# Altium project BluePitch.PrjPCB
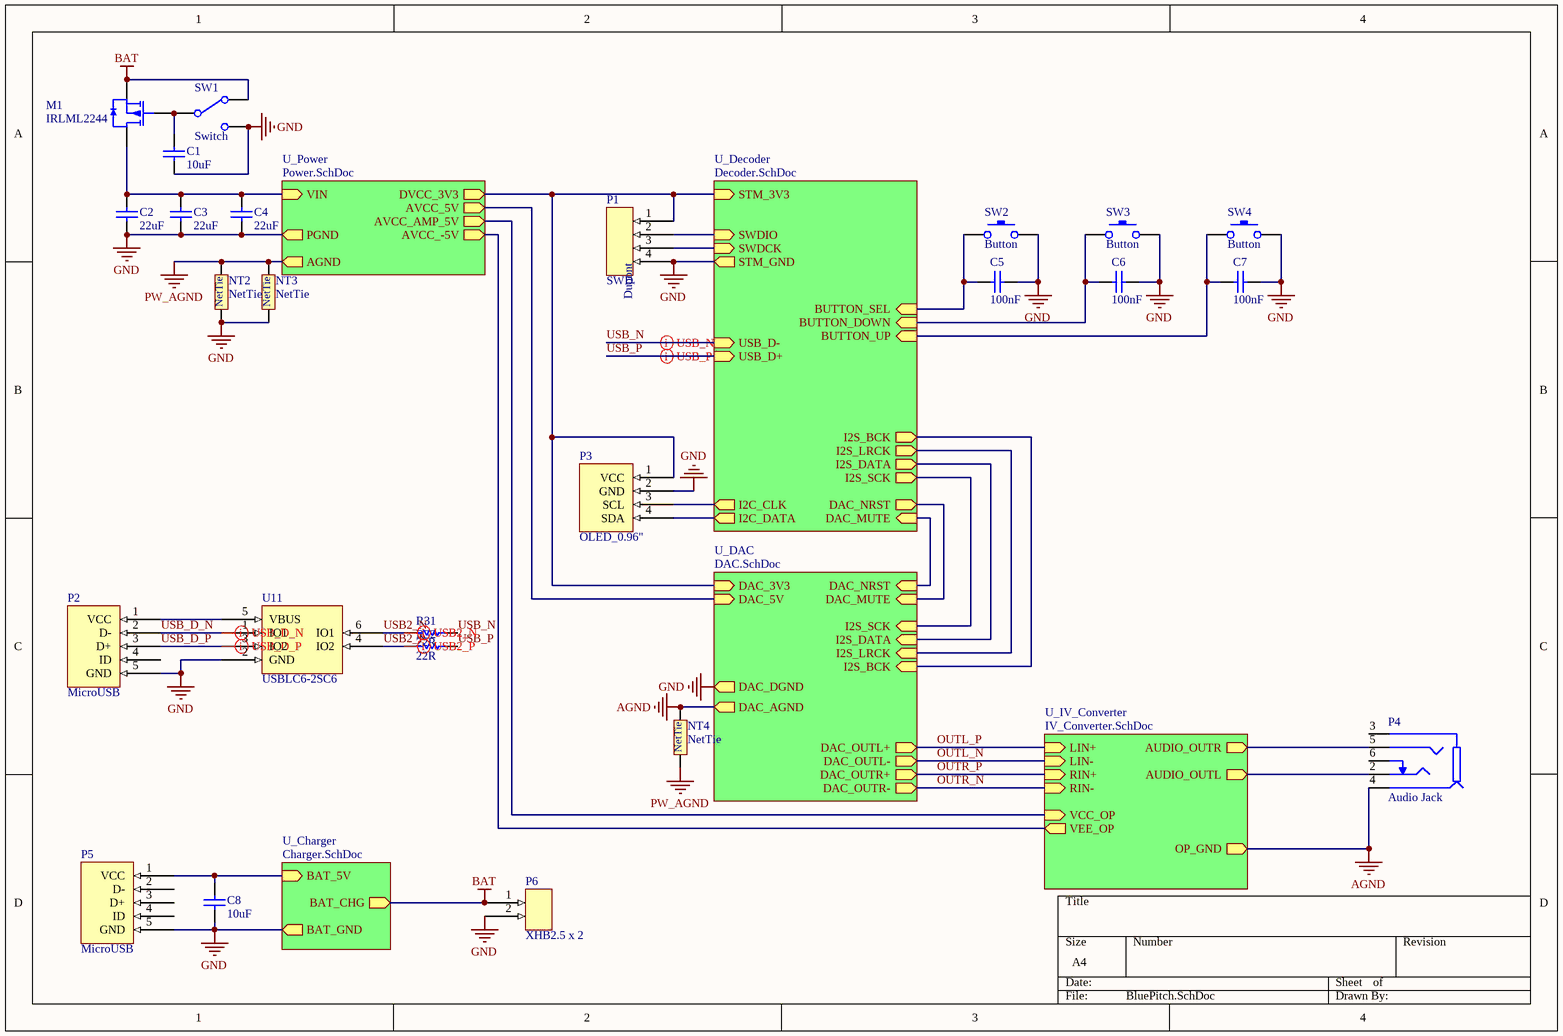
[diagram p0: BluePitch.SchDoc]
6 sheets, 145 parts. Net scope: hierarchical (ports join the sheet entries above them; power ports are global).
Board file: BluePitch.PcbDoc
Sheets:
  BluePitch.SchDoc
    U_DAC = DAC.SchDoc
    U_Decoder = Decoder.SchDoc
    U_IV_Converter = IV_Converter.SchDoc
    U_Power = Power.SchDoc
    U_Charger = Charger.SchDoc

## Sheet BluePitch.SchDoc
size A4

### Parts
C1  10uF  [SMC_0805]
C2  22uF  [SMC_1206]
C3  22uF  [SMC_1206]
C4  22uF  [SMC_1206]
C5  100nF  [SMC_0402]
C6  100nF  [SMC_0402]
C7  100nF  [SMC_0402]
C8  10uF  [SMC_0805]
M1  IRLML2244  [SOT95P237X112-3N]
NT2  NetTie  [NT_20]  (net tie, no BOM)
NT3  NetTie  [NT_20]  (net tie, no BOM)
NT4  NetTie  [NT_20]  (net tie, no BOM)
P1  SWD  [Dupont Female x 4]
P2  MicroUSB  [MicroUSB]
P3  OLED_0.96"  [OLED 0.96"]
P4  Audio Jack  [PJ-327A]
P5  MicroUSB  [MicroUSB]
P6  XHB2.5 x 2  [XHB2.5 x 2]
R31  22R  [SMR_0402]
R32  22R  [SMR_0402]
SW1  Switch  [Switch]
SW2  Button  [Button]
SW3  Button  [Button]
SW4  Button  [Button]
U11  USBLC6-2SC6  [SOT95P280X145-6N]

### Sub-sheets
U_Charger = Charger.SchDoc: BAT_5V (in), BAT_CHG (out), BAT_GND (out)
U_DAC = DAC.SchDoc: I2S_LRCK (in), I2S_DATA (in), I2S_BCK (in), I2S_SCK (in), DAC_MUTE (in), DAC_OUTL- (out), DAC_OUTL+ (out), DAC_OUTR- (out), DAC_OUTR+ (out), DAC_NRST (in), DAC_3V3 (in), DAC_DGND (out), DAC_AGND (out), DAC_5V (in)
U_Decoder = Decoder.SchDoc: I2S_DATA (out), I2S_LRCK (out), I2S_BCK (out), I2S_SCK (out), USB_D+ (in), USB_D- (in), SWDIO (in), SWDCK (in), I2C_CLK (out), I2C_DATA (out), STM_3V3 (in), STM_GND (out), BUTTON_UP (in), BUTTON_DOWN (in), BUTTON_SEL (in), DAC_MUTE (in), DAC_NRST (out)
U_IV_Converter = IV_Converter.SchDoc: AUDIO_OUTL (out), LIN+ (in), LIN- (in), AUDIO_OUTR (out), RIN+ (in), RIN- (in), VCC_OP (in), OP_GND (out), VEE_OP (out)
U_Power = Power.SchDoc: DVCC_3V3 (out), PGND (out), AGND (out), VIN (in), AVCC_-5V (out), AVCC_5V (out), AVCC_AMP_5V (out)

### Nets
AGND: NT4.2 P4.4(SLEEVE/L) ; sheet U_DAC/DAC_AGND, sheet U_IV_Converter/OP_GND
AMP_5V: sheet U_IV_Converter/VCC_OP, sheet U_Power/AVCC_AMP_5V
AMP_-5V: sheet U_IV_Converter/VEE_OP, sheet U_Power/AVCC_-5V
BAT: M1.S P6.1 SW1.2 ; sheet U_Charger/BAT_CHG
DAC_3V3: C2.2 C3.2 C4.2 M1.D P1.1 P3.1(VCC) ; sheet U_DAC/DAC_3V3, sheet U_Decoder/STM_3V3, sheet U_Power/DVCC_3V3, sheet U_Power/VIN
DAC_5V: sheet U_DAC/DAC_5V, sheet U_Power/AVCC_5V
GND: C1.1 C2.1 C3.1 C4.1 C5.2 C6.2 C7.2 C8.1 NT2.1 NT3.1 P1.4 P2.5(GND) P3.2(GND) P5.5(GND) P6.2 SW1.3 SW2.2 SW3.2 SW4.2 U11.2(GND) ; sheet U_DAC/DAC_DGND, sheet U_Decoder/STM_GND, sheet U_Power/PGND, sheet U_Charger/BAT_GND  [project net DAC_DGND]
PW_AGND: NT2.2 NT3.2 NT4.1 ; sheet U_Power/AGND  [project net PAGND]
VCHG: C8.2 P5.1(VCC) ; sheet U_Charger/BAT_5V
OUTL_N: sheet U_DAC/DAC_OUTL-, sheet U_IV_Converter/LIN-
OUTL_P: sheet U_DAC/DAC_OUTL+, sheet U_IV_Converter/LIN+
OUTR_N: sheet U_DAC/DAC_OUTR-, sheet U_IV_Converter/RIN-
OUTR_P: sheet U_DAC/DAC_OUTR+, sheet U_IV_Converter/RIN+
USB2_N: R31.1 U11.6(IO1)
USB2_P: R32.1 U11.4(IO2)
USB_D_N: P2.2(D-) U11.1(IO1)
USB_D_P: P2.3(D+) U11.3(IO2)
USB_N: R31.2 ; sheet U_Decoder/USB_D-
USB_P: R32.2 ; sheet U_Decoder/USB_D+
NetC1_2: C1.2 M1.G SW1.1
NetC5_1: C5.1 SW2.1 ; sheet U_Decoder/BUTTON_SEL
NetC6_1: C6.1 SW3.1 ; sheet U_Decoder/BUTTON_DOWN
NetC7_1: C7.1 SW4.1 ; sheet U_Decoder/BUTTON_UP
NetP1_2: P1.2 ; sheet U_Decoder/SWDIO
NetP1_3: P1.3 ; sheet U_Decoder/SWDCK
NetP2_1: P2.1(VCC) U11.5(VBUS)
NetP3_3: P3.3(SCL) ; sheet U_Decoder/I2C_CLK
NetP3_4: P3.4(SDA) ; sheet U_Decoder/I2C_DATA
NetP4_2: P4.2(L) ; sheet U_IV_Converter/AUDIO_OUTL
NetP4_5: P4.5(R) ; sheet U_IV_Converter/AUDIO_OUTR
NetR5_2: sheet U_DAC/DAC_NRST, sheet U_Decoder/DAC_MUTE
NetU2_4: sheet U_DAC/I2S_LRCK, sheet U_Decoder/I2S_LRCK
NetU2_5: sheet U_DAC/I2S_DATA, sheet U_Decoder/I2S_DATA
NetU2_6: sheet U_DAC/I2S_BCK, sheet U_Decoder/I2S_BCK
NetU2_7: sheet U_DAC/I2S_SCK, sheet U_Decoder/I2S_SCK
NetU2_10: sheet U_DAC/DAC_MUTE, sheet U_Decoder/DAC_NRST

Not connected (* = marked no-connect by the designer): P2 4(ID); P4 3(SLEEVE) 6(CONT); P5 2(D-) 3(D+) 4(ID)

### Layout directives
differential pair: USB2_N, USB2_P, USB_D_N, USB_D_P, USB_N, USB_P

### Notes on the sheet
- (in symbol Dupont Header x 4) Dupont

### Library data of the parts
C1-C8 = Cap Ceramic
P1 = Dupont Header x 4
R31 R32 = Res SMT

## Sheet DAC.SchDoc
size A4
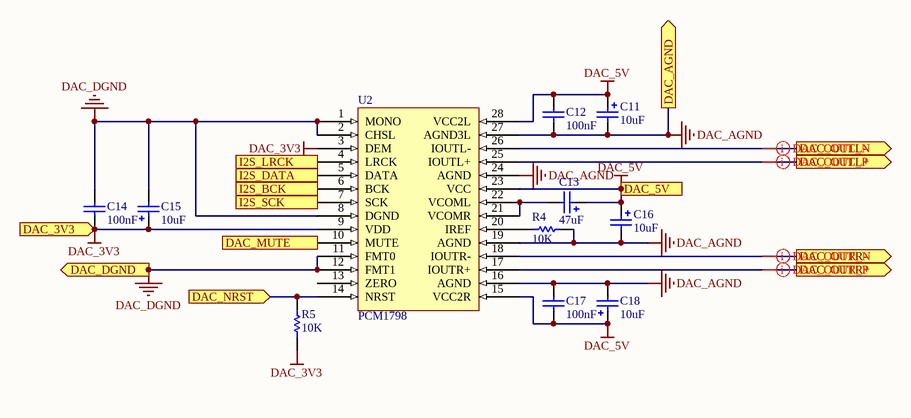
[diagram p1: DAC.SchDoc]

### Parts
C11  10uF  [THT_Cap5x11]
C12  100nF  [SMC_0402]
C13  47uF  [THT_Cap5x11]
C14  100nF  [SMC_0402]
C15  10uF  [THT_Cap5x11]
C16  10uF  [THT_Cap5x11]
C17  100nF  [SMC_0402]
C18  10uF  [THT_Cap5x11]
R4  10K  [SMR_0402]
R5  10K  [SMR_0402]
U2  PCM1798  [SOP65P780X200-28N]

### Ports
DAC_3V3 (in), DAC_5V (in), DAC_AGND (out), DAC_DGND (out), DAC_MUTE (in), DAC_NRST (in), DAC_OUTL+ (out), DAC_OUTL- (out), DAC_OUTR+ (out), DAC_OUTR- (out), I2S_BCK (in), I2S_DATA (in), I2S_LRCK (in), I2S_SCK (in)

### Nets
DAC_3V3: C14.1 C15.A R5.1 U2.3(DEM) U2.9(VDD) ; port DAC_3V3
DAC_5V: C11.A C12.2 C13.A C16.A C17.2 C18.A U2.15(VCC2R) U2.23(VCC) U2.28(VCC2L) ; port DAC_5V
DAC_AGND: C11.K C12.1 C16.K C17.1 C18.K R4.2 U2.16(AGND) U2.19(AGND) U2.24(AGND) U2.27(AGND3L) ; port DAC_AGND  [project net AGND]
DAC_DGND: C14.2 C15.K U2.1(MONO) U2.2(CHSL) U2.8(DGND) U2.11(FMT0) U2.12(FMT1) ; port DAC_DGND
OUTL_N: U2.26(IOUTL-) ; port DAC_OUTL-
OUTL_P: U2.25(IOUTL+) ; port DAC_OUTL+
OUTR_N: U2.18(IOUTR-) ; port DAC_OUTR-
OUTR_P: U2.17(IOUTR+) ; port DAC_OUTR+
NetC13_K: C13.K U2.21(VCOMR) U2.22(VCOML)
NetR4_1: R4.1 U2.20(IREF)
NetR5_2: R5.2 U2.14(NRST) ; port DAC_NRST
NetU2_4: U2.4(LRCK) ; port I2S_LRCK
NetU2_5: U2.5(DATA) ; port I2S_DATA
NetU2_6: U2.6(BCK) ; port I2S_BCK
NetU2_7: U2.7(SCK) ; port I2S_SCK
NetU2_10: U2.10(MUTE) ; port DAC_MUTE

Not connected (* = marked no-connect by the designer): U2 13(ZERO)

### Layout directives
differential pair: OUTL_N, OUTL_P, OUTR_N, OUTR_P

### Library data of the parts
C11 C13 C15 C16 C18 = Cap Electrolyte
C12 C14 C17 = Cap Ceramic
R4 R5 = Res SMT

## Sheet Decoder.SchDoc
size A4
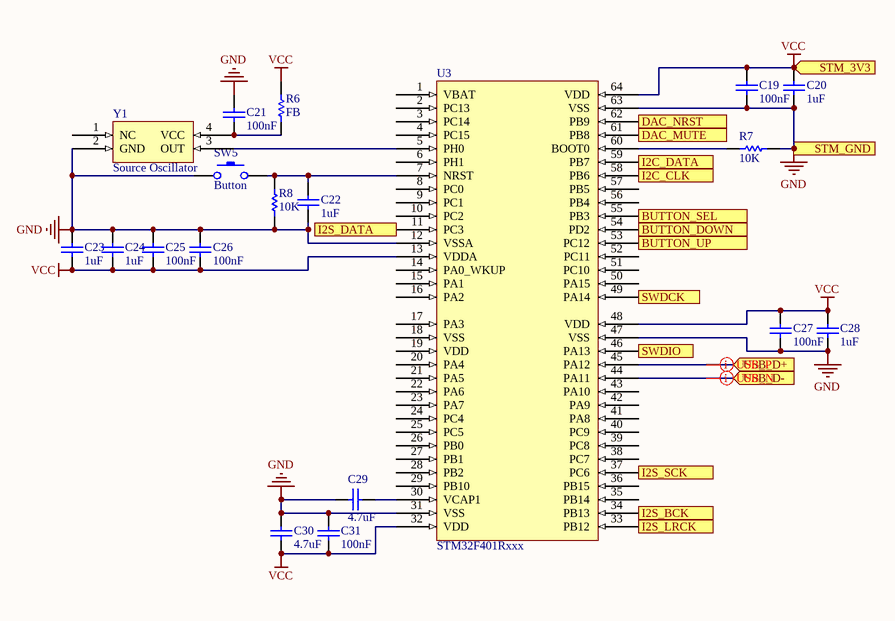
[diagram p2: Decoder.SchDoc]

### Parts
C19  100nF  [SMC_0402]
C20  1uF  [SMC_0402]
C21  100nF  [SMC_0402]
C22  1uF  [SMC_0402]
C23  1uF  [SMC_0402]
C24  1uF  [SMC_0402]
C25  100nF  [SMC_0402]
C26  100nF  [SMC_0402]
C27  100nF  [SMC_0402]
C28  1uF  [SMC_0402]
C29  4.7uF  [SMC_0402]
C30  4.7uF  [SMC_0402]
C31  100nF  [SMC_0402]
R6  FB  [SMR_0603]
R7  10K  [SMR_0402]
R8  10K  [SMR_0402]
SW5  Button  [Button]
U3  STM32F401Rxxx  [TSQFP50P1200X1200X160-64N]
Y1  Source Oscillator  [SMD_3225]

### Ports
BUTTON_DOWN (in), BUTTON_SEL (in), BUTTON_UP (in), DAC_MUTE (in), DAC_NRST (out), I2C_CLK (out), I2C_DATA (out), I2S_BCK (out), I2S_DATA (out), I2S_LRCK (out), I2S_SCK (out), STM_3V3 (in), STM_GND (out), SWDCK (in), SWDIO (in), USB_D+ (in), USB_D- (in)

### Nets
GND: C19.1 C20.1 C21.2 C22.1 C23.2 C24.2 C25.2 C26.2 C27.1 C28.1 C29.1 C30.2 C31.2 R7.2 R8.2 SW5.1 U3.12(VSSA) U3.31(VSS) U3.47(VSS) U3.63(VSS) Y1.2(GND) ; port STM_GND  [project net DAC_DGND]
VCC: C19.2 C20.2 C23.1 C24.1 C25.1 C26.1 C27.2 C28.2 C30.1 C31.1 R6.2 U3.13(VDDA) U3.32(VDD) U3.48(VDD) U3.64(VDD) ; port STM_3V3  [project net DAC_3V3]
USB_N: U3.44(PA11) ; port USB_D-
USB_P: U3.45(PA12) ; port USB_D+
NetC5_1: U3.55(PB3) ; port BUTTON_SEL
NetC6_1: U3.54(PD2) ; port BUTTON_DOWN
NetC7_1: U3.53(PC12) ; port BUTTON_UP
NetC21_1: C21.1 R6.1 Y1.4(VCC)
NetC22_2: C22.2 R8.1 SW5.2 U3.7(NRST)
NetC29_2: C29.2 U3.30(VCAP1)
NetP1_2: U3.46(PA13) ; port SWDIO
NetP1_3: U3.49(PA14) ; port SWDCK
NetP3_3: U3.58(PB6) ; port I2C_CLK
NetP3_4: U3.59(PB7) ; port I2C_DATA
NetR5_2: U3.61(PB8) ; port DAC_MUTE
NetR7_1: R7.1 U3.60(BOOT0)
NetU2_4: U3.33(PB12) ; port I2S_LRCK
NetU2_5: U3.11(PC3) ; port I2S_DATA
NetU2_6: U3.34(PB13) ; port I2S_BCK
NetU2_7: U3.37(PC6) ; port I2S_SCK
NetU2_10: U3.62(PB9) ; port DAC_NRST
NetU3_5: U3.5(PH0) Y1.3(OUT)

Not connected (* = marked no-connect by the designer): U3 1(VBAT) 2(PC13) 3(PC14) 4(PC15) 6(PH1) 8(PC0) 9(PC1) 10(PC2) 14(PA0_WKUP) 15(PA1) 16(PA2) 17(PA3) 18(VSS) 19(VDD) 20(PA4) 21(PA5) 22(PA6) 23(PA7) 24(PC4) 25(PC5) 26(PB0) 27(PB1) 28(PB2) 29(PB10) 35(PB14) 36(PB15) 38(PC7) 39(PC8) 40(PC9) 41(PA8) 42(PA9) 43(PA10) 50(PA15) 51(PC10) 52(PC11) 56(PB4) 57(PB5); Y1 1(NC)

### Layout directives
differential pair: USB_N, USB_P

### Library data of the parts
C19-C31 = Cap Ceramic
R6-R8 = Res SMT

## Sheet IV_Converter.SchDoc
size A4
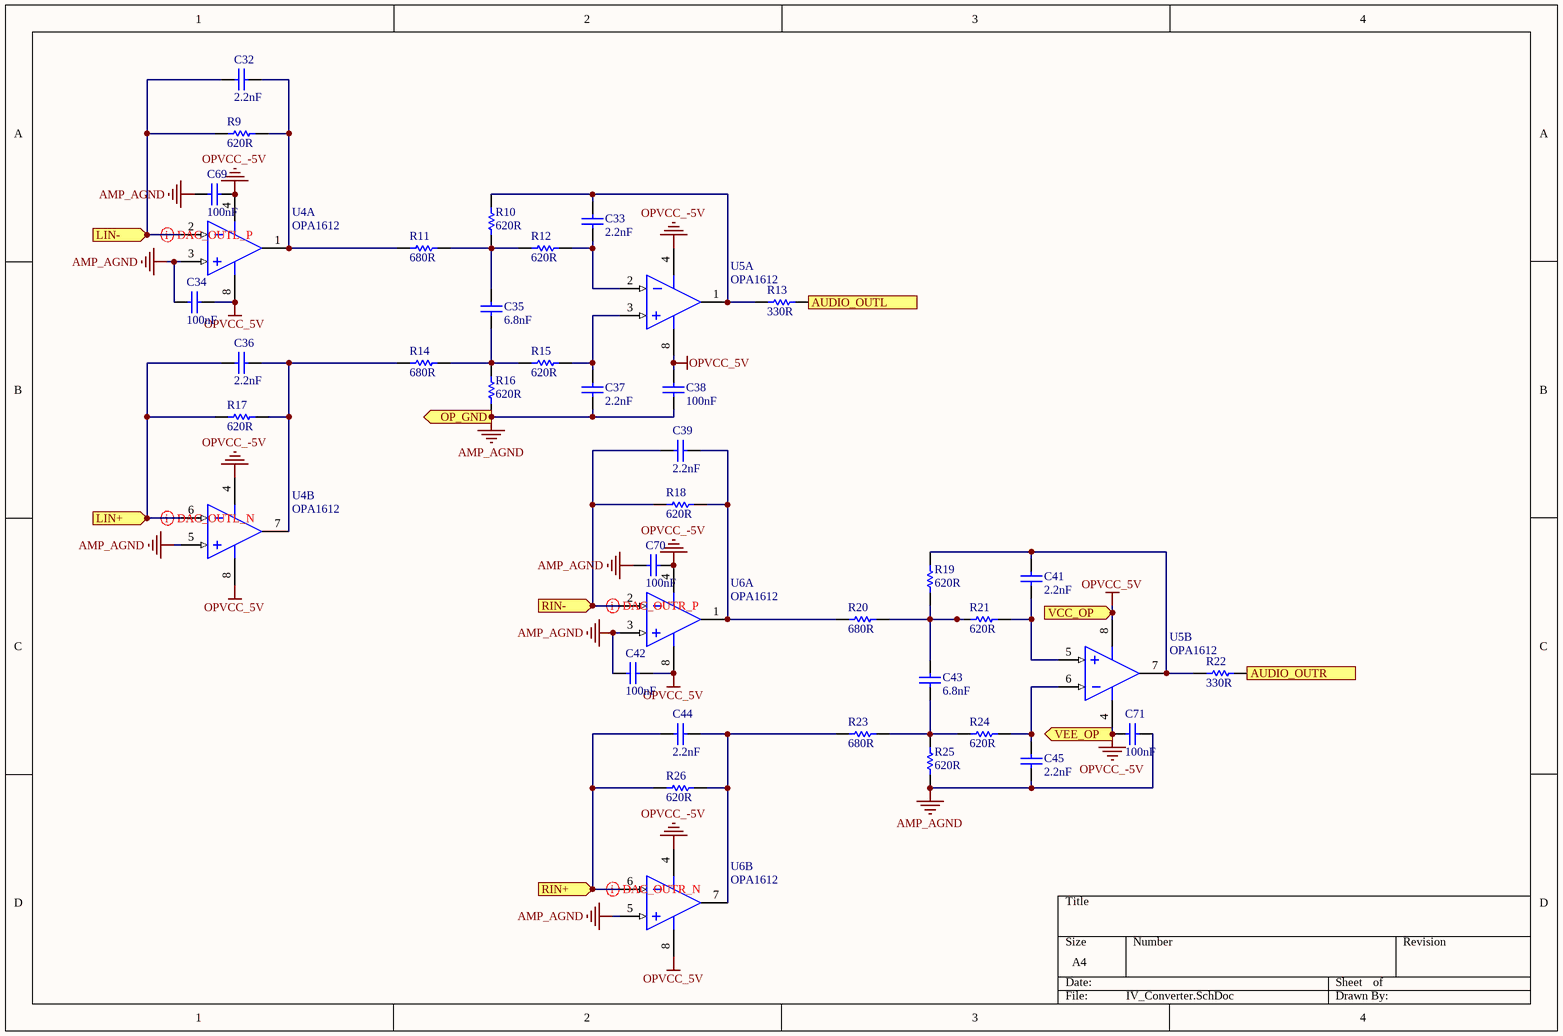
[diagram p3: IV_Converter.SchDoc]

### Parts
C32  2.2nF  [SMC_0805]
C33  2.2nF  [SMC_0805]
C34  100nF  [SMC_0402]
C35  6.8nF  [SMC_0805]
C36  2.2nF  [SMC_0805]
C37  2.2nF  [SMC_0805]
C38  100nF  [SMC_0402]
C39  2.2nF  [SMC_0805]
C41  2.2nF  [SMC_0805]
C42  100nF  [SMC_0402]
C43  6.8nF  [SMC_0805]
C44  2.2nF  [SMC_0805]
C45  2.2nF  [SMC_0805]
C69  100nF  [SMC_0402]
C70  100nF  [SMC_0402]
C71  100nF  [SMC_0402]
R9  620R  [SMR_0805]
R10  620R  [SMR_0805]
R11  680R  [SMR_0805]
R12  620R  [SMR_0805]
R13  330R  [SMR_0805]
R14  680R  [SMR_0805]
R15  620R  [SMR_0805]
R16  620R  [SMR_0805]
R17  620R  [SMR_0805]
R18  620R  [SMR_0805]
R19  620R  [SMR_0805]
R20  680R  [SMR_0805]
R21  620R  [SMR_0805]
R22  330R  [SMR_0805]
R23  680R  [SMR_0805]
R24  620R  [SMR_0805]
R25  620R  [SMR_0805]
R26  620R  [SMR_0805]
U4  OPA1612  [SOIC127P600X175-8N]  (parts A,B of 2)
U5  OPA1612  [SOIC127P600X175-8N]  (parts A,B of 2)
U6  OPA1612  [SOIC127P600X175-8N]  (parts A,B of 2)

### Ports
AUDIO_OUTL (out), AUDIO_OUTR (out), LIN+ (in), LIN- (in), OP_GND (out), RIN+ (in), RIN- (in), VCC_OP (in), VEE_OP (out)

### Nets
AMP_AGND: C34.1 C37.1 C38.1 C42.1 C45.1 C69.1 C70.1 C71.2 R16.1 R25.1 U4.3(IN+) U4.5(IN+) U6.3(IN+) U6.5(IN+) ; port OP_GND  [project net AGND]
OPVCC_5V: C34.2 C38.2 C42.2 U4.8(V+) U5.8(V+) U6.8(V+) ; port VCC_OP  [project net AMP_5V]
OPVCC_-5V: C69.2 C70.2 C71.1 U4.4(V-) U5.4(V-) U6.4(V-) ; port VEE_OP  [project net AMP_-5V]
OUTL_N: C32.1 R9.1 U4.2(IN-) ; port LIN-
OUTL_P: C36.1 R17.1 U4.6(IN-) ; port LIN+
OUTR_N: C39.1 R18.1 U6.2(IN-) ; port RIN-
OUTR_P: C44.1 R26.1 U6.6(IN-) ; port RIN+
NetC32_2: C32.2 R9.2 R11.1 U4.1(OUT)
NetC33_1: C33.1 R12.1 U5.2(IN-)
NetC33_2: C33.2 R10.2 R13.1 U5.1(OUT)
NetC35_1: C35.1 R14.2 R15.2 R16.2
NetC35_2: C35.2 R10.1 R11.2 R12.2
NetC36_2: C36.2 R14.1 R17.2 U4.7(OUT)
NetC37_2: C37.2 R15.1 U5.3(IN+)
NetC39_2: C39.2 R18.2 R20.1 U6.1(OUT)
NetC41_1: C41.1 R21.1 U5.5(IN+)
NetC41_2: C41.2 R19.2 R22.1 U5.7(OUT)
NetC43_1: C43.1 R23.2 R24.2 R25.2
NetC43_2: C43.2 R19.1 R20.2 R21.2
NetC44_2: C44.2 R23.1 R26.2 U6.7(OUT)
NetC45_2: C45.2 R24.1 U5.6(IN-)
NetP4_2: R13.2 ; port AUDIO_OUTL
NetP4_5: R22.2 ; port AUDIO_OUTR

### Layout directives
differential pair: OUTL_N, OUTL_P, OUTR_N, OUTR_P

### Library data of the parts
C32-C39 C41-C45 C69-C71 = Cap Ceramic
R9-R26 = Res SMT
U4-U6 = LM358D

## Sheet Power.SchDoc
size A4
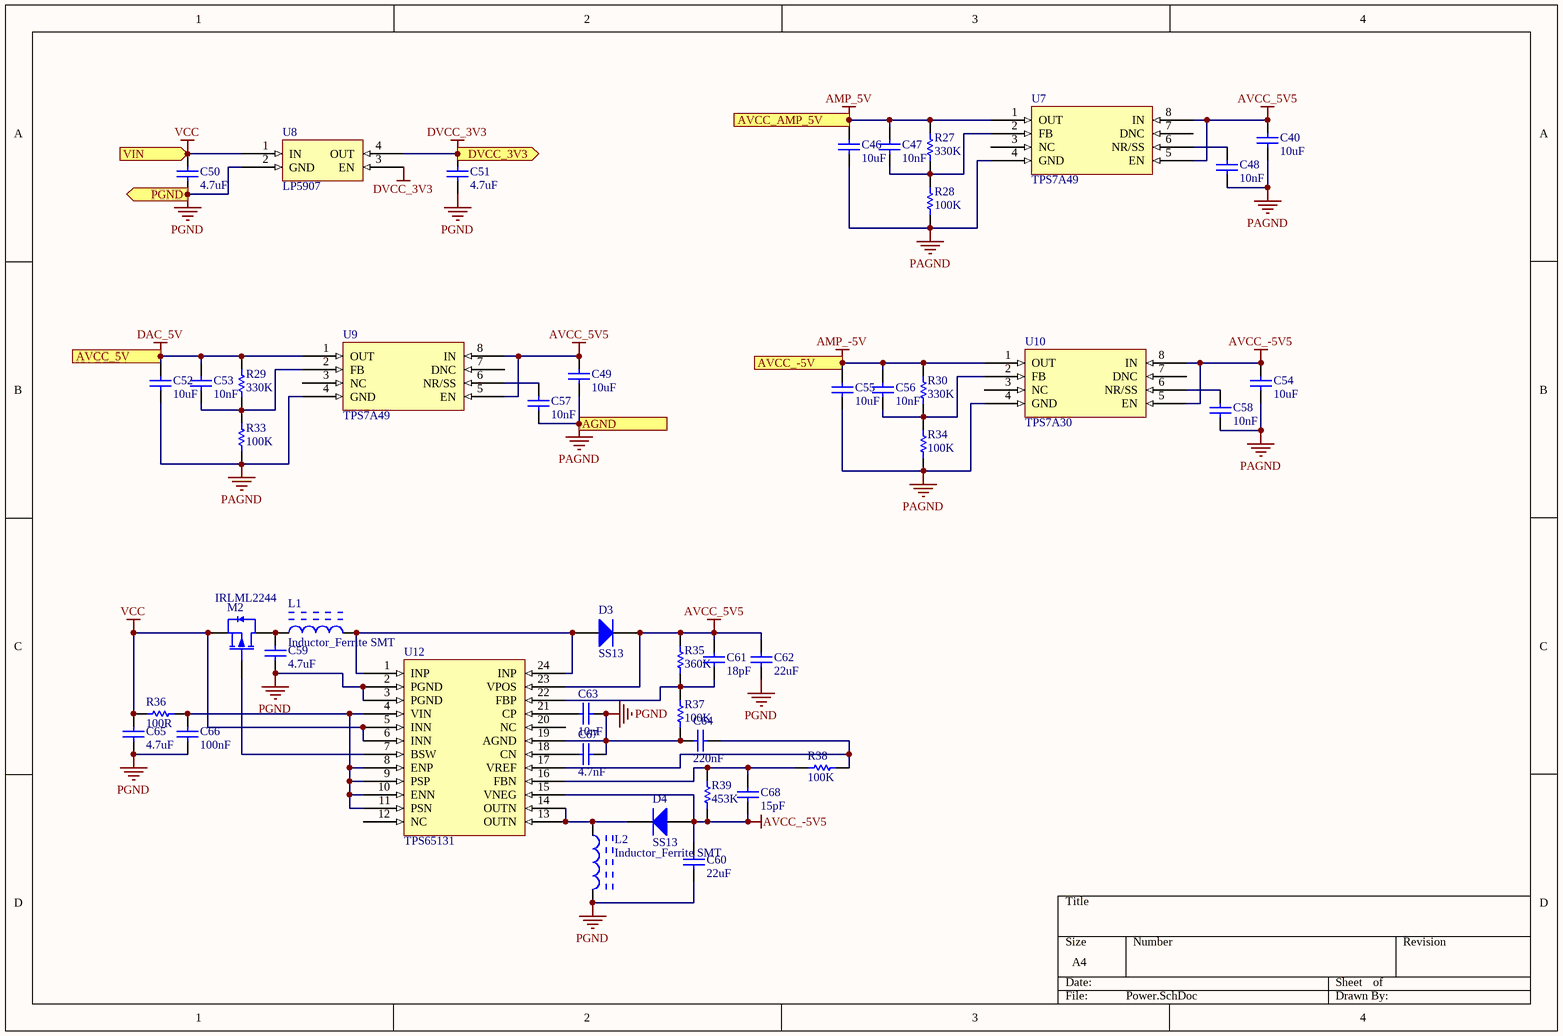
[diagram p4: Power.SchDoc]

### Parts
C40  10uF  [SMC_0805]
C46  10uF  [SMC_0805]
C47  10nF  [SMC_0805]
C48  10nF  [SMC_0805]
C49  10uF  [SMC_0805]
C50  4.7uF  [SMC_0805]
C51  4.7uF  [SMC_0805]
C52  10uF  [SMC_0805]
C53  10nF  [SMC_0805]
C54  10uF  [SMC_0805]
C55  10uF  [SMC_0805]
C56  10nF  [SMC_0805]
C57  10nF  [SMC_0805]
C58  10nF  [SMC_0805]
C59  4.7uF  [SMC_0805]
C60  22uF  [SMC_0805]
C61  18pF  [SMC_0805]
C62  22uF  [SMC_0805]
C63  10nF  [SMC_0805]
C64  220nF  [SMC_0805]
C65  4.7uF  [SMC_0805]
C66  100nF  [SMC_0805]
C67  4.7nF  [SMC_0805]
C68  15pF  [SMC_0805]
D3  SS13  [DO214-AC]
D4  SS13  [DO214-AC]
L1  Inductor_Ferrite SMT  [SML_4x4]
L2  Inductor_Ferrite SMT  [SML_4x4]
M2  IRLML2244  [SOT95P237X112-3N]
R27  330K  [SMR_0402]
R28  100K  [SMR_0402]
R29  330K  [SMR_0402]
R30  330K  [SMR_0402]
R33  100K  [SMR_0402]
R34  100K  [SMR_0402]
R35  360K  [SMR_0402]
R36  100R  [SMR_0805]
R37  100K  [SMR_0402]
R38  100K  [SMR_0402]
R39  453K  [SMR_0402]
U7  TPS7A49  [TSOP65P490X110_HS-9N]
U8  LP5907  [SOT95P280X110-5N - duplicate1]
U9  TPS7A49  [TSOP65P490X110_HS-9N]
U10  TPS7A30  [TSOP65P490X110_HS-9N]
U12  TPS65131  [QFN50P400X400X100_HS-25N]

### Ports
AGND (out), AVCC_5V (out), AVCC_-5V (out), AVCC_AMP_5V (out), DVCC_3V3 (out), PGND (out), VIN (in)

### Nets
AMP_5V: C46.1 C47.2 R27.2 U7.1(OUT) ; port AVCC_AMP_5V
AMP_-5V: C55.1 C56.2 R30.2 U10.1(OUT) ; port AVCC_-5V
AVCC_5V5: C40.1 C49.1 C61.2 C62.2 D3.K R35.2 U7.5(EN) U7.8(IN) U9.5(EN) U9.8(IN) U12.23(VPOS)
AVCC_-5V5: C54.1 C60.2 C68.1 D4.A R39.1 U10.5(EN) U10.8(IN) U12.15(VNEG)
DAC_5V: C52.1 C53.2 R29.2 U9.1(OUT) ; port AVCC_5V
DVCC_3V3: C50.2 C51.2 C65.2 M2.S R36.1 U8.1(IN) U8.3(EN) U8.4(OUT) U12.5(INN) U12.6(INN) ; port DVCC_3V3, port VIN  [also labelled VCC]  [project net DAC_3V3]
PAGND: C40.2 C46.2 C48.1 C49.2 C52.2 C54.2 C55.2 C57.1 C58.1 R28.1 R33.1 R34.1 U7.4(GND) U9.4(GND) U10.4(GND) ; port AGND
PGND: C50.1 C51.1 C59.1 C60.1 C62.1 C63.2 C64.1 C65.1 C66.1 C67.2 L2.2 R37.1 U8.2(GND) U12.2(PGND) U12.3(PGND) U12.19(AGND) ; port PGND  [project net DAC_DGND]
NetC47_1: C47.1 R27.1 R28.2 U7.2(FB)
NetC48_2: C48.2 U7.6(NR/SS)
NetC53_1: C53.1 R29.1 R33.2 U9.2(FB)
NetC56_1: C56.1 R30.1 R34.2 U10.2(FB)
NetC57_2: C57.2 U9.6(NR/SS)
NetC58_2: C58.2 U10.6(NR/SS)
NetC59_2: C59.2 L1.1 M2.D
NetC61_1: C61.1 R35.1 R37.2 U12.22(FBP)
NetC63_1: C63.1 U12.21(CP)
NetC64_2: C64.2 R38.2 U12.17(VREF)
NetC66_2: C66.2 R36.2 U12.4(VIN) U12.8(ENP) U12.9(PSP) U12.10(ENN) U12.11(PSN)
NetC67_1: C67.1 U12.18(CN)
NetC68_2: C68.2 R38.1 R39.2 U12.16(FBN)
NetD3_A: D3.A L1.2 U12.1(INP) U12.24(INP)
NetD4_K: D4.K L2.1 U12.13(OUTN) U12.14(OUTN)
NetM2_G: M2.G U12.7(BSW)

Not connected (* = marked no-connect by the designer): U7 3(NC) 7(DNC); U9 3(NC) 7(DNC); U10 3(NC) 7(DNC); U12 12(NC) 20(NC)

### Library data of the parts
C40 C46-C68 = Cap Ceramic
D3 D4 = Diode
R27-R30 R33-R39 = Res SMT

## Sheet Charger.SchDoc
size A4
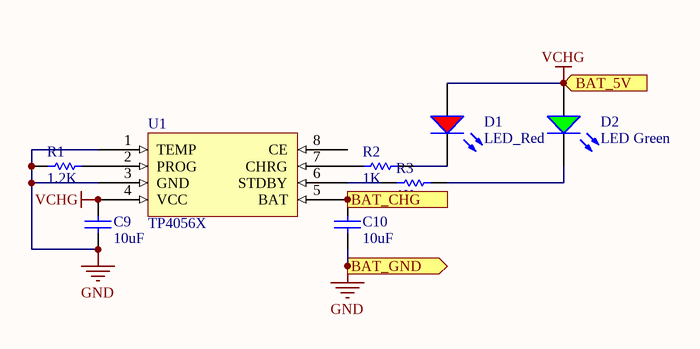
[diagram p5: Charger.SchDoc]

### Parts
C9  10uF  [SMC_0805]
C10  10uF  [SMC_0805]
D1  LED_Red  [SMLED_0603]
D2  LED Green  [SMLED_0603]
R1  1.2K  [SMR_0402]
R2  1K  [SMR_0402]
R3  1K  [SMR_0402]
U1  TP4056X  [SOIC127P600X175_HS-9N]

### Ports
BAT_5V (in), BAT_CHG (out), BAT_GND (out)

### Nets
BAT: C10.2 U1.5(BAT) ; port BAT_CHG
GND: C9.1 C10.1 R1.1 U1.1(TEMP) U1.3(GND) ; port BAT_GND  [project net DAC_DGND]
VCHG: C9.2 D1.A D2.A U1.4(VCC) ; port BAT_5V
NetD1_K: D1.K R2.2
NetD2_K: D2.K R3.2
NetR1_2: R1.2 U1.2(PROG)
NetR2_1: R2.1 U1.7(CHRG)
NetR3_1: R3.1 U1.6(STDBY)

Not connected (* = marked no-connect by the designer): U1 8(CE)

### Library data of the parts
C9 C10 = Cap Ceramic
R1-R3 = Res SMT

## Nets that join several sheets
AGND: BluePitch (NT4.2 P4.4), DAC (10 pins), IV_Converter (14 pins)
AMP_5V: IV_Converter (6 pins), Power (C46.1 C47.2 R27.2 U7.1)
AMP_-5V: IV_Converter (6 pins), Power (C55.1 C56.2 R30.2 U10.1)
BAT: BluePitch (M1.S P6.1 SW1.2), Charger (C10.2 U1.5)
DAC_3V3: BluePitch (6 pins), DAC (5 pins), Decoder (15 pins), Power (10 pins)
DAC_5V: DAC (9 pins), Power (C52.1 C53.2 R29.2 U9.1)
DAC_DGND: BluePitch (20 pins), DAC (7 pins), Decoder (21 pins), Power (16 pins), Charger (5 pins)
PAGND: BluePitch (NT2.2 NT3.2 NT4.1), Power (15 pins)
VCHG: BluePitch (C8.2 P5.1), Charger (C9.2 D1.A D2.A U1.4)
NetC5_1: BluePitch (C5.1 SW2.1), Decoder (U3.55)
NetC6_1: BluePitch (C6.1 SW3.1), Decoder (U3.54)
NetC7_1: BluePitch (C7.1 SW4.1), Decoder (U3.53)
NetP1_2: BluePitch (P1.2), Decoder (U3.46)
NetP1_3: BluePitch (P1.3), Decoder (U3.49)
NetP3_3: BluePitch (P3.3), Decoder (U3.58)
NetP3_4: BluePitch (P3.4), Decoder (U3.59)
NetP4_2: BluePitch (P4.2), IV_Converter (R13.2)
NetP4_5: BluePitch (P4.5), IV_Converter (R22.2)
NetR5_2: DAC (R5.2 U2.14), Decoder (U3.61)
NetU2_4: DAC (U2.4), Decoder (U3.33)
NetU2_5: DAC (U2.5), Decoder (U3.11)
NetU2_6: DAC (U2.6), Decoder (U3.34)
NetU2_7: DAC (U2.7), Decoder (U3.37)
NetU2_10: DAC (U2.10), Decoder (U3.62)
OUTL_N: DAC (U2.26), IV_Converter (C32.1 R9.1 U4.2)
OUTL_P: DAC (U2.25), IV_Converter (C36.1 R17.1 U4.6)
OUTR_N: DAC (U2.18), IV_Converter (C39.1 R18.1 U6.2)
OUTR_P: DAC (U2.17), IV_Converter (C44.1 R26.1 U6.6)
USB_N: BluePitch (R31.2), Decoder (U3.44)
USB_P: BluePitch (R32.2), Decoder (U3.45)